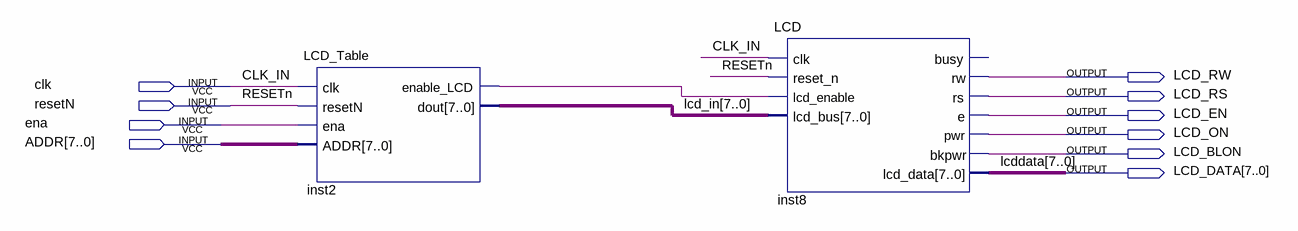
[diagram p0: schematic sheet]
// Quartus schematic 2LCD.bdf as structural Verilog: 2 symbols, 10 pins
module \2LCD  (
  input  clk,
  input  resetN,
  input  ena,
  input  [7:0] ADDR,
  output LCD_RW,
  output LCD_RS,
  output LCD_EN,
  output LCD_ON,
  output LCD_BLON,
  output [7:0] LCD_DATA
);

  wire inst2_enable_lcd;
  wire [7:0] lcd_in;

  LCD_Table inst2 (.clk(clk), .resetN(resetN), .ena(ena), .ADDR(ADDR), .enable_LCD(inst2_enable_lcd), .dout(lcd_in));
  LCD inst8 (
    .clk(clk), .reset_n(resetN), .lcd_enable(inst2_enable_lcd), .lcd_bus(lcd_in), .rw(LCD_RW), .rs(LCD_RS),
    .e(LCD_EN), .pwr(LCD_ON), .bkpwr(LCD_BLON), .lcd_data(LCD_DATA));  // open: busy

  // Other names for the same wires on the sheet: CLK_IN = clk; lcddata[7:0] = LCD_DATA
endmodule
